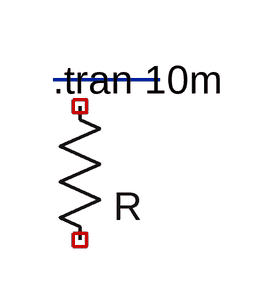
[diagram p0: schematic invalid_04_line_4.asc]
invalid_04_line_4.asc, the LTspice schematic file:
Version 4.1
SHEET 1 880 680
WIRE 0 0 64 0
SYMBOL res 0 0 R360
TEXT 0 0 Left 2 !.tran 10m

The netlist it stands for:
* invalid_04_line_4.asc
R§? NC_01 NC_02 R
.tran 10m
.backanno
.end